# Altium schematic sheet 原理图.SchDoc
size A4
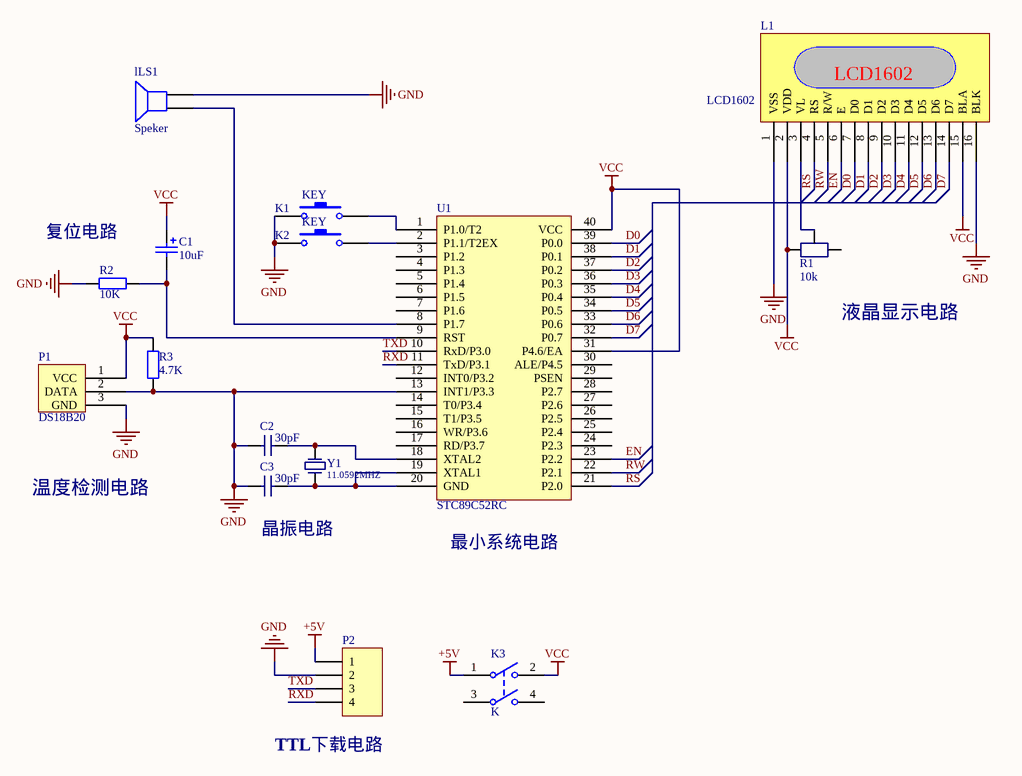
[diagram p0: 原理图.SchDoc]

## Parts
C1  value 10uF  [cap4]  (hidden comment: Cap-polarity)
C2  value 30pF  [cap-2.545]  (hidden comment: Cap)
C3  value 30pF  [cap-2.545]  (hidden comment: Cap)
K1  KEY2  [KEY4]  (value not drawn)
K2  KEY2  [KEY4]  (value not drawn)
K3  K  [Switch-Single]
L1  LCD1602  [LCD1602]
lLS1  Speker  [SPK-interface]
P1  DS18B20  [PNP]
P2  Header 4  [HDR1X4]  (value not drawn)
R1  value 10k  [RES1]  (hidden comment: RES1)
R2  RES: 10K  [RES2 AXIAL-0.4]  (hidden comment: RES)
R3  RES: 4.7K  [RES2 AXIAL-0.4]  (hidden comment: RES)
U1  STC89C52RC  [DIP-40]
Y1  value 11.0592MHZ  [XALT2]  (hidden comment: XTAL)

## Nets
+5V: K3.1 P2.1
GND: C2.1 C3.1 K1.1 K2.1 L1.1(VSS) L1.16(BLK) lLS1.2 P1.2(DATA) P1.3(GND) P2.2 R2.1 R3.2 U1.13(INT1/P3.3)
VCC: C1.1 K3.2(NO1) L1.2(VDD) L1.15(BLA) P1.1(VCC) R1.1 R3.1 U1.31(P4.6/EA) U1.40(VCC)
D0: L1.7(D0) U1.39(P0.0)
D1: L1.8(D1) U1.38(P0.1)
D2: L1.9(D2) U1.37(P0.2)
D3: L1.10(D3) U1.36(P0.3)
D4: L1.11(D4) U1.35(P0.4)
D5: L1.12(D5) U1.34(P0.5)
D6: L1.13(D6) U1.33(P0.6)
D7: L1.14(D7) U1.32(P0.7)
EN: L1.6(E) U1.23(P2.2)
RS: L1.4(RS) U1.21(P2.0)
RW: L1.5(R/W) U1.22(P2.1)
RXD: P2.4 U1.11(TxD/P3.1)
TXD: P2.3 U1.10(RxD/P3.0)
NetC1_2: C1.2 R2.2 U1.9(RST)
NetC2_2: C2.2 U1.18(XTAL2) Y1.2
NetC3_2: C3.2 U1.19(XTAL1) U1.20(GND) Y1.1
NetK1_2: K1.2 U1.1(P1.0/T2)
NetK2_2: K2.2 U1.2(P1.1/T2EX)
NetL1_3: L1.3(VL) R1.2
NetlLS1_1: lLS1.1 U1.8(P1.7)

Not connected (* = marked no-connect by the designer): K3 3(COMMON2) 4(NO2); R1 3; U1 3(P1.2) 4(P1.3) 5(P1.4) 6(P1.5) 7(P1.6) 12(INT0/P3.2) 14(T0/P3.4) 15(T1/P3.5) 16(WR/P3.6) 17(RD/P3.7) 24(P2.3) 25(P2.4) 26(P2.5) 27(P2.6) 28(P2.7) 29(PSEN) 30(ALE/P4.5)

## Notes on the sheet
- (near R2) 复位电路
- 液晶显示电路
- 温度检测电路
- 晶振电路
- (near U1) 最小系统电路
- (near P2) TTL下载电路
- (in symbol KEY2) KEY

## Library data of the parts
K3 = Switch-Single
lLS1 = Speker: Loudspeaker
P2 = Header 4: Header, 4-Pin; LatestRevisionDate: 17-Jul-2002; LatestRevisionNote: Re-released for DXP Platform.; Publisher: Altium Limited
U1 = STC89C52RC: DIP40